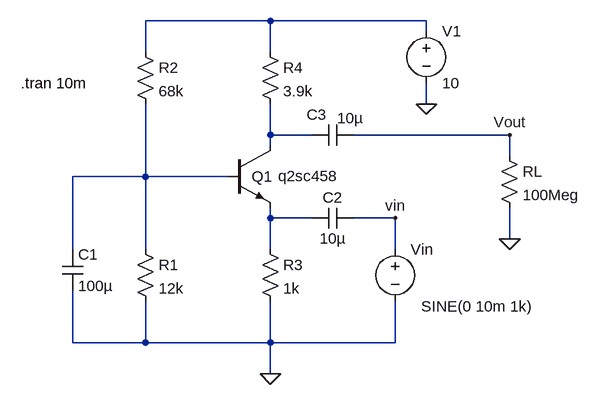
[diagram p0: schematic 1-3(2nd).asc]
1-3(2nd).asc, the LTspice schematic file:
Version 4
SHEET 1 880 680
WIRE 384 -96 192 -96
WIRE 624 -96 384 -96
WIRE 624 -80 624 -96
WIRE 192 -48 192 -96
WIRE 384 -48 384 -96
WIRE 624 32 624 0
WIRE 384 80 384 32
WIRE 448 80 384 80
WIRE 752 80 512 80
WIRE 384 96 384 80
WIRE 752 112 752 80
WIRE 192 144 192 32
WIRE 192 144 80 144
WIRE 320 144 192 144
WIRE 384 208 384 192
WIRE 448 208 384 208
WIRE 576 208 512 208
WIRE 752 240 752 192
WIRE 80 256 80 144
WIRE 192 256 192 144
WIRE 384 256 384 208
WIRE 576 256 576 208
WIRE 80 400 80 320
WIRE 192 400 192 336
WIRE 192 400 80 400
WIRE 384 400 384 336
WIRE 384 400 192 400
WIRE 576 400 576 336
WIRE 576 400 384 400
WIRE 384 448 384 400
FLAG 384 448 0
FLAG 752 240 0
FLAG 752 80 Vout
FLAG 624 32 0
FLAG 576 208 vin
SYMBOL cap 64 256 R0
SYMATTR InstName C1
SYMATTR Value 100µ
SYMBOL res 176 240 R0
SYMATTR InstName R1
SYMATTR Value 12k
SYMBOL res 176 -64 R0
SYMATTR InstName R2
SYMATTR Value 68k
SYMBOL npn 320 96 R0
WINDOW 0 35 48 Left 2
WINDOW 3 76 47 Left 2
SYMATTR InstName Q1
SYMATTR Value q2sc458
SYMBOL res 368 240 R0
SYMATTR InstName R3
SYMATTR Value 1k
SYMBOL voltage 576 240 R0
WINDOW 123 0 0 Left 0
WINDOW 39 0 0 Left 0
WINDOW 3 40 104 Left 2
SYMATTR InstName Vin
SYMATTR Value SINE(0 10m 1k)
SYMBOL cap 512 192 R90
WINDOW 0 0 32 VBottom 2
WINDOW 3 32 32 VTop 2
SYMATTR InstName C2
SYMATTR Value 10µ
SYMBOL cap 512 64 R90
WINDOW 0 0 57 VBottom 2
WINDOW 3 -26 5 VTop 2
SYMATTR InstName C3
SYMATTR Value 10µ
SYMBOL res 368 -64 R0
SYMATTR InstName R4
SYMATTR Value 3.9k
SYMBOL res 736 96 R0
SYMATTR InstName RL
SYMATTR Value 100Meg
SYMBOL voltage 624 -96 R0
WINDOW 123 0 0 Left 0
WINDOW 39 0 0 Left 0
SYMATTR InstName V1
SYMATTR Value 10
TEXT 0 0 Left 2 !.tran 10m

The netlist it stands for:
* 1-3(2nd).asc
C1 N003 0 100µ
R1 N003 0 12k
R2 N001 N003 68k
Q1 N002 N003 N004 0 q2sc458
R3 N004 0 1k
Vin vin 0 SINE(0 10m 1k)
C2 vin N004 10µ
C3 Vout N002 10µ
R4 N001 N002 3.9k
RL Vout 0 100Meg
V1 N001 0 10
.model NPN NPN
.model PNP PNP
.lib standard.bjt
.tran 10m
.backanno
.end